# Altium project pump_controller_project.PrjPcb (part 2 of 2)

## Sheet MCU.SchDoc
size A3; SheetNumber: 9; SheetTotal: 9
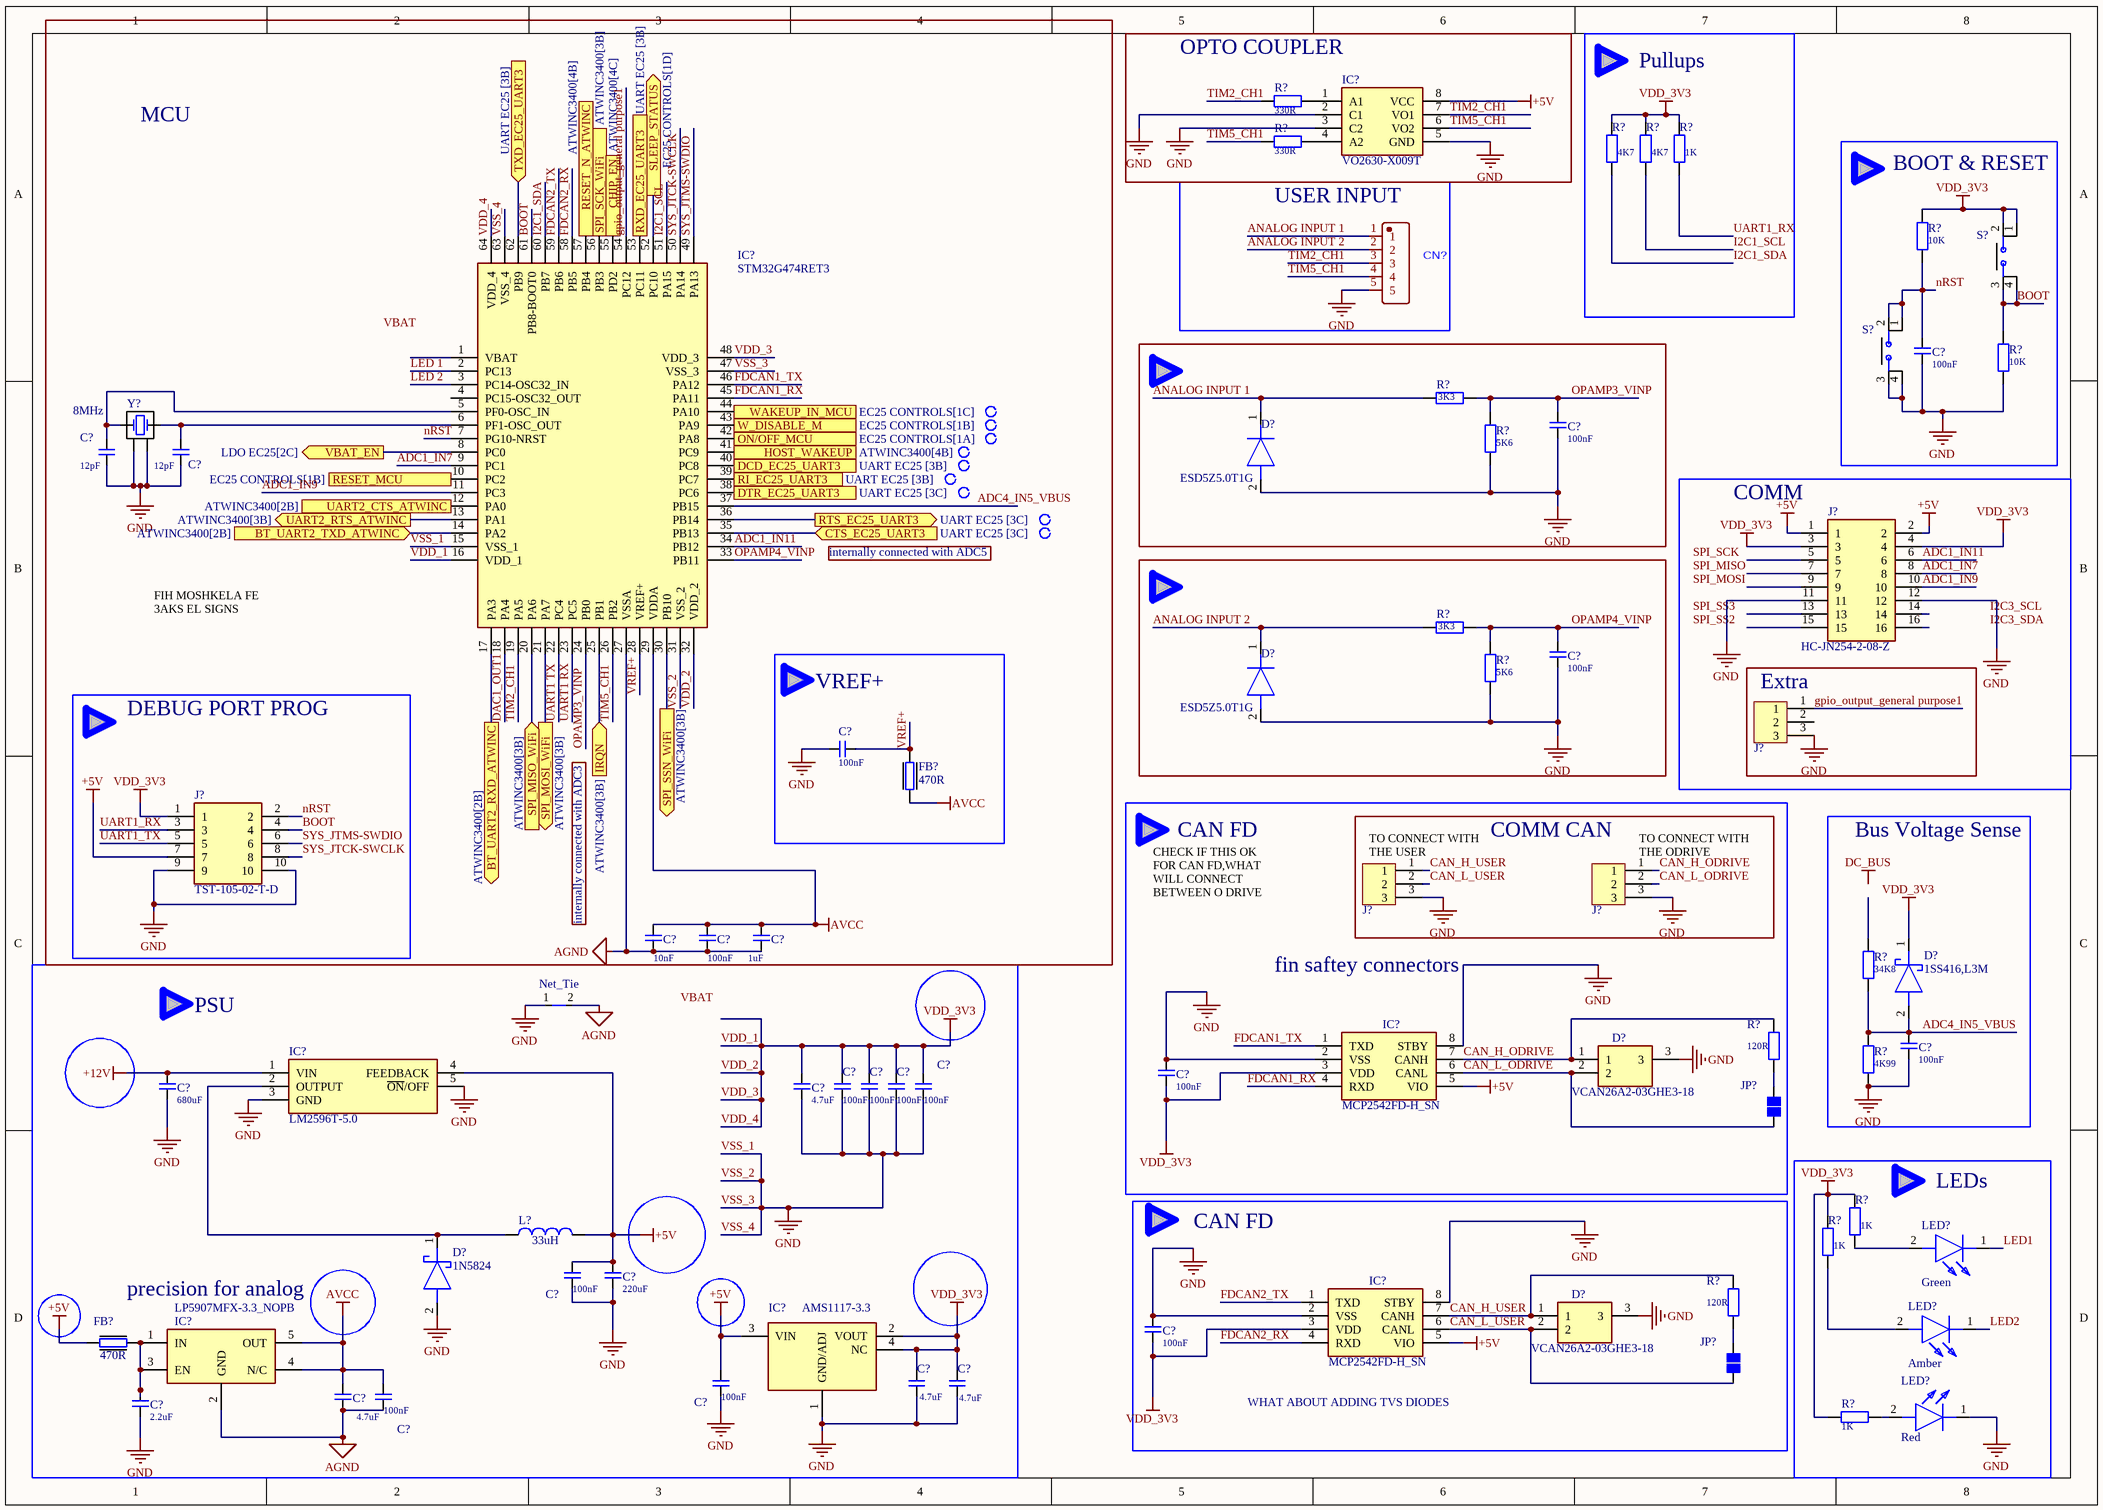
[diagram p10: MCU.SchDoc]

### Parts
(Parts that share a designator on the sheet are numbered #1, #2 ... from top to bottom, then left to right.)
C?#30  value 100nF  [CAPC1005X06N]  (hidden comment: Cap)
C?#31  value 100nF  [CAPC1005X06N]  (hidden comment: Cap)
C?#32  value 12pF  [CAPC1005X06N]  (hidden comment: Cap)
C?#33  value 12pF  [CAPC1005X06N]  (hidden comment: Cap)
C?#34  value 100nF  [CAPC1005X06N]  (hidden comment: Cap)
C?#35  value 100nF  [CAPC1005X06N]  (hidden comment: Cap)
C?#36  value 10nF  [CAPC1005X06N]  (hidden comment: Cap)
C?#37  value 100nF  [CAPC1005X06N]  (hidden comment: Cap)
C?#38  value 1uF  [CAPC1005X06N]  (hidden comment: Cap)
C?#39  value 100nF  [CAPC1005X06N]  (hidden comment: Cap)
C?#40  value 100nF  [CAPC1005X06N]  (hidden comment: Cap)
C?#41  value 680uF  [CAPC1005X06N]  (hidden comment: Cap)
C?#42  value 4.7uF  [CAPC3225X17N]  (hidden comment: Cap)
C?#43  value 100nF  [CAPC1005X06N]  (hidden comment: Cap)
C?#44  value 100nF  [CAPC1005X06N]  (hidden comment: Cap)
C?#45  value 100nF  [CAPC1005X06N]  (hidden comment: Cap)
C?#46  value 100nF  [CAPC1005X06N]  (hidden comment: Cap)
C?#47  value 100nF  [CAPC1005X06N]  (hidden comment: Cap)
C?#48  value 220uF  [CAPC1005X06N]  (hidden comment: Cap)
C?#49  value 100nF  [CAPC1005X06N]  (hidden comment: Cap)
C?#50  value 100nF  [CAPC1005X06N]  (hidden comment: Cap)
C?#51  value 4.7uF  [CAPC3225X17N]  (hidden comment: Cap)
C?#52  value 4.7uF  [CAPC3225X17N]  (hidden comment: Cap)
C?#53  value 4.7uF  [CAPC3225X17N]  (hidden comment: Cap)
C?#54  value 100nF  [CAPC1005X06N]  (hidden comment: Cap)
C?#55  value 2.2uF  [CAPC1005X06N]  (hidden comment: Cap)
CN?  (no value)  [CONN-TH_BX-XH2.54-5PZZ-Y]
D?#5  ESD5Z5.0T1G  [SODFL1608X70N]
D?#6  ESD5Z5.0T1G  [SODFL1608X70N]
D?#7  1SS416,L3M  [SODFL1006X45N]
D?#8  VCAN26A2-03GHE3-18  [SOT65P230X110-3N]
D?#9  1N5824  [1N5824]
D?#10  VCAN26A2-03GHE3-18  [SOT65P230X110-3N]
FB?#1  value 470R  [BLM18SP221SN1B]  (hidden comment: 470 OHM)
FB?#2  value 470R  [BLM18SP221SN1B]  (hidden comment: 470 OHM)
IC?#3  VO2630-X009T  [VO2630X009T]
IC?#4  STM32G474RET3  [QFP50P1200X1200X160-64N]
IC?#5  MCP2542FD-H_SN  [SOIC127P600X175-8N]
IC?#6  LM2596T-5.0  [TO170P470X1028X2142-5P]
IC?#7  MCP2542FD-H_SN  [SOIC127P600X175-8N]
IC?#8  AMS1117-3.3  [SOT229P700X180-4N]
IC?#9  LP5907MFX-3.3_NOPB  [SOT95P280X145-5N]
J?#6  MPN: HC-JN254-2-08-Z  [SHDR16W64P254_2X8_2794X927X940P]  (hidden comment: TST-108-02-T-D)
J?#7  XH2_54_3p  [XH2.54-3P]  (value not drawn)
J?#8  TST-105-02-T-D  [TST-105-XX-Y-D]
J?#9  XH2_54_3p  [XH2.54-3P]  (value not drawn)
J?#10  XH2_54_3p  [XH2.54-3P]  (value not drawn)
JP?#1  Jumper  [Jumper]  (value not drawn)  (no BOM)
JP?#2  Jumper  [Jumper]  (value not drawn)  (no BOM)
L?#2  value 33uH  [INDP6060X30N]  (hidden comment: L)
LED?#4  Green  [LEDC1608X80N]
LED?#5  Amber  [LEDC1608X80N]
LED?#6  Red  [LEDC1608X80N]
NT?  Net_Tie  [Net_Tie_SMD]  (net tie, no BOM)
R?#33  value 330R  [RESC1005X04N]  (hidden comment: R)
R?#34  value 330R  [RESC1005X04N]  (hidden comment: R)
R?#35  value 4K7  [RESC1005X04N]  (hidden comment: R)
R?#36  value 4K7  [RESC1005X04N]  (hidden comment: R)
R?#37  value 1K  [RESC1005X04N]  (hidden comment: R)
R?#38  value 10K  [RESC1005X04N]  (hidden comment: R)
R?#39  value 10K  [RESC1005X04N]  (hidden comment: R)
R?#40  value 3K3  [RESC1005X04N]  (hidden comment: R)
R?#41  value 5K6  [RESC1005X04N]  (hidden comment: R)
R?#42  value 3K3  [RESC1005X04N]  (hidden comment: R)
R?#43  value 5K6  [RESC1005X04N]  (hidden comment: R)
R?#44  value 34K8  [RESC1005X04N]  (hidden comment: R)
R?#45  value 120R  [RESC3216X06N]  (hidden comment: R)
R?#46  value 4K99  [RESC1005X04N]  (hidden comment: R)
R?#47  value 1K  [RESC1005X04N]  (hidden comment: R)
R?#48  value 1K  [RESC1005X04N]  (hidden comment: R)
R?#49  value 120R  [RESC3216X06N]  (hidden comment: R)
R?#50  value 1K  [RESC1005X04N]  (hidden comment: R)
S?#1  TS18-5-25-SL-260-SMT-TR  [TS18525SL260SMTTR]  (value not drawn)
S?#2  TS18-5-25-SL-260-SMT-TR  [TS18525SL260SMTTR]  (value not drawn)
Y?  value 8MHz  [830105863709]

### Blocks framed on the sheet
MCU: C?#32 C?#33 C?#36-C?#38 IC?#4 Y?
OPTO COUPLER: IC?#3 R?#33 R?#34
Pullups: R?#35-R?#37
BOOT & RESET: C?#30 R?#38 R?#39 S?#1 S?#2
USER INPUT: CN?
COMM: J?#6
VREF+: C?#35 FB?#1
Extra: J?#7
DEBUG PORT PROG: J?#8
COMM CAN: J?#9 J?#10
Bus Voltage Sense: C?#39 D?#7 R?#44 R?#46
CAN FD: C?#49 D?#10 IC?#7 JP?#2 R?#49
LEDs: LED?#4-LED?#6 R?#47 R?#48 R?#50

### Ports
BT_UART2_RXD_ATWINC (out, see ATWINC3400[2B]), BT_UART2_TXD_ATWINC (in, see ATWINC3400[2B]), CHIP_EN (out, see ATWINC3400[4C]), CTS_EC25_UART3 (in, see UART EC25 [3C]), DCD_EC25_UART3 (in, see UART EC25 [3B]), DTR_EC25_UART3 (out, see UART EC25 [3C]), HOST_WAKEUP (out, see ATWINC3400[4B]), IRQN (in, see ATWINC3400[3B]), ON/OFF_MCU (out, see EC25 CONTROLS[1A]), RESET_MCU (out, see EC25 CONTROLS[1B]), RESET_N_ATWINC (out, see ATWINC3400[4B]), RI_EC25_UART3 (in, see UART EC25 [3B]), RTS_EC25_UART3 (out, see UART EC25 [3C]), RXD_EC25_UART3 (out, see UART EC25 [3B]), SLEEP_STATUS (out, see EC25 CONTROLS[1D]), SPI_MISO_WiFi (in, see ATWINC3400[3B]), SPI_MOSI_WiFi (out, see ATWINC3400[3B]), SPI_SCK_WiFi (out, see ATWINC3400[3B]), SPI_SSN_WiFi (out, see ATWINC3400[3B]), TXD_EC25_UART3 (in, see UART EC25 [3B]), UART2_CTS_ATWINC (in, see ATWINC3400[2B]), UART2_RTS_ATWINC (out, see ATWINC3400[3B]), VBAT_EN (out, see LDO EC25[2C]), W_DISABLE_M (out, see EC25 CONTROLS[1B]), WAKEUP_IN_MCU (out, see EC25 CONTROLS[1C])

### Nets
+5V: C?#47.2 C?#48.2 C?#50.2 FB?#2.1 IC?#3.8(VCC) IC?#5.5(VIO) IC?#6.4(FEEDBACK) IC?#7.5(VIO) IC?#8.3(VIN) J?#6.1 J?#6.2 J?#8.7 L?#2.2
+12V: C?#41.2 IC?#6.1(VIN)
AGND: C?#36.2 C?#37.1 C?#38.2 C?#53.1 C?#54.1 IC?#4.27(VSSA) IC?#9.2(GND) NT?.2
AVCC: C?#36.1 C?#37.2 C?#38.1 C?#53.2 C?#54.2 FB?#1.1 IC?#4.29(VDDA) IC?#9.4(N/C) IC?#9.5(OUT)
VDD_1: C?#40.2 C?#42.2 C?#43.2 C?#44.2 C?#45.2 C?#46.2 C?#49.2 C?#51.2 C?#52.2 D?#7.1(K) IC?#4.16(VDD_1) IC?#4.32(VDD_2) IC?#4.48(VDD_3) IC?#4.64(VDD_4) IC?#5.3(VDD) IC?#7.3(VDD) IC?#8.2(VOUT) IC?#8.4(NC) J?#6.3 J?#6.4 J?#8.1 R?#35.1 R?#36.1 R?#37.1 R?#38.2 R?#47.1 R?#48.1 R?#50.2 S?#1.1(NO_1) S?#1.2(NO_2)  [also labelled VDD_2, VDD_3, VDD_3V3, VDD_4]
VSS_1: C?#30.1 C?#31.1 C?#32.1 C?#33.1 C?#34.1 C?#35.1 C?#39.1 C?#40.1 C?#41.1 C?#42.1 C?#43.1 C?#44.1 C?#45.1 C?#46.1 C?#47.1 C?#48.1 C?#49.1 C?#50.1 C?#51.1 C?#52.1 C?#55.1 CN?.5 D?#5.2(A) D?#6.2(A) D?#8.3 D?#9.2(A) D?#10.3 IC?#3.2(C1) IC?#3.3(C2) IC?#3.5(GND) IC?#4.15(VSS_1) IC?#4.31(VSS_2) IC?#4.47(VSS_3) IC?#4.63(VSS_4) IC?#5.2(VSS) IC?#5.8(STBY) IC?#6.3(GND) IC?#6.5(~{ON}/OFF) IC?#7.2(VSS) IC?#7.8(STBY) IC?#8.1(GND/ADJ) J?#6.11 J?#6.12 J?#7.3 J?#8.9 J?#8.10 J?#9.3 J?#10.3 LED?#6.1(K) NT?.1 R?#39.1 R?#41.2 R?#43.2 R?#46.2 S?#2.3(COM_1) S?#2.4(COM_2) Y?.2(GND_&_LID_1) Y?.4(GND_&_LID_2)  [also labelled GND, VSS_2, VSS_3, VSS_4]
ADC1_IN7: IC?#4.9(PC1) J?#6.8
ADC1_IN9: IC?#4.11(PC3) J?#6.10
ADC1_IN11: IC?#4.34(PB12) J?#6.6
ADC4_IN5_VBUS: C?#39.2 D?#7.2(A) IC?#4.37(PB15) R?#44.2 R?#46.1
ANALOG INPUT 1: CN?.1 D?#5.1(K) R?#40.2
ANALOG INPUT 2: CN?.2 D?#6.1(K) R?#42.2
BOOT: IC?#4.61(PB8-BOOT0) J?#8.4 R?#39.2 S?#1.3(COM_1) S?#1.4(COM_2)
CAN_H_ODRIVE: D?#8.1 IC?#5.7(CANH) J?#10.1 R?#45.2
CAN_H_USER: D?#10.1 IC?#7.7(CANH) J?#9.1 R?#49.2
CAN_L_ODRIVE: D?#8.2 IC?#5.6(CANL) J?#10.2 JP?#1.1
CAN_L_USER: D?#10.2 IC?#7.6(CANL) J?#9.2 JP?#2.1
DAC1_OUT1: IC?#4.18(PA4)
FDCAN1_RX: IC?#4.45(PA11) IC?#5.4(RXD)
FDCAN1_TX: IC?#4.46(PA12) IC?#5.1(TXD)
FDCAN2_RX: IC?#4.58(PB5) IC?#7.4(RXD)
FDCAN2_TX: IC?#4.59(PB6) IC?#7.1(TXD)
gpio_output_general purpose1: IC?#4.54(PC12) J?#7.1
I2C1_SCL: IC?#4.51(PA15) R?#36.2
I2C1_SDA: IC?#4.60(PB7) R?#35.2
LED1: LED?#4.1(K)
LED2: LED?#5.1(K)
LED 1: IC?#4.2(PC13)
LED 2: IC?#4.3(PC14-OSC32_IN)
nRST: C?#30.2 IC?#4.7(PG10-NRST) J?#8.2 R?#38.1 S?#2.1(NO_1) S?#2.2(NO_2)
OPAMP3_VINP: C?#31.2 IC?#4.24(PB0) R?#40.1 R?#41.1
OPAMP4_VINP: C?#34.2 IC?#4.33(PB11) R?#42.1 R?#43.1
SYS_JTCK-SWCLK: IC?#4.50(PA14) J?#8.8
SYS_JTMS-SWDIO: IC?#4.49(PA13) J?#8.6
TIM2_CH1: CN?.3 IC?#3.7(VO1) IC?#4.19(PA5) R?#33.1
TIM5_CH1: CN?.4 IC?#3.6(VO2) IC?#4.26(PB2) R?#34.1
UART1 RX: IC?#4.23(PC5)
UART1 TX: IC?#4.22(PC4)
UART1_RX: J?#8.3 R?#37.2
UART1_TX: J?#8.5
VREF+: C?#35.2 FB?#1.2 IC?#4.28(VREF+)
NetC?#32_2: C?#32.2 IC?#4.5(PF0-OSC_IN) Y?.1(CRYSTAL__1)
NetC?#33_2: C?#33.2 IC?#4.6(PF1-OSC_OUT) Y?.3(CRYSTAL__2)
NetC?#55_2: C?#55.2 FB?#2.2 IC?#9.1(IN) IC?#9.3(EN)
NetD?#9_1: D?#9.1(K) IC?#6.2(OUTPUT) L?#2.1
NetIC?#1_12: IC?#4.36(PB14) ; port RTS_EC25_UART3
NetIC?#1_13: IC?#4.35(PB13) ; port CTS_EC25_UART3
NetIC?#1_14: IC?#4.38(PC6) ; port DTR_EC25_UART3
NetIC?#1_15: IC?#4.39(PC7) ; port RI_EC25_UART3
NetIC?#1_16: IC?#4.53(PC11) ; port RXD_EC25_UART3
NetIC?#1_17: IC?#4.62(PB9) ; port TXD_EC25_UART3
NetIC?#1_18: IC?#4.40(PC8) ; port DCD_EC25_UART3
NetIC?#3_1: IC?#3.1(A1) R?#33.2
NetIC?#3_4: IC?#3.4(A2) R?#34.2
NetIC?#4_8: IC?#4.8(PC0) ; port VBAT_EN
NetIC?#4_10: IC?#4.10(PC2) ; port RESET_MCU
NetIC?#4_12: IC?#4.12(PA0) ; port UART2_CTS_ATWINC
NetIC?#4_13: IC?#4.13(PA1) ; port UART2_RTS_ATWINC
NetIC?#4_14: IC?#4.14(PA2) ; port BT_UART2_TXD_ATWINC
NetIC?#4_17: IC?#4.17(PA3) ; port BT_UART2_RXD_ATWINC
NetIC?#4_20: IC?#4.20(PA6) ; port SPI_MISO_WiFi
NetIC?#4_21: IC?#4.21(PA7) ; port SPI_MOSI_WiFi
NetIC?#4_25: IC?#4.25(PB1) ; port IRQN
NetIC?#4_30: IC?#4.30(PB10) ; port SPI_SSN_WiFi
NetIC?#4_41: IC?#4.41(PC9) ; port HOST_WAKEUP
NetIC?#4_42: IC?#4.42(PA8) ; port ON/OFF_MCU
NetIC?#4_43: IC?#4.43(PA9) ; port W_DISABLE_M
NetIC?#4_44: IC?#4.44(PA10) ; port WAKEUP_IN_MCU
NetIC?#4_52: IC?#4.52(PC10) ; port SLEEP_STATUS
NetIC?#4_55: IC?#4.55(PD2) ; port CHIP_EN
NetIC?#4_56: IC?#4.56(PB3) ; port SPI_SCK_WiFi
NetIC?#4_57: IC?#4.57(PB4) ; port RESET_N_ATWINC
NetJP?#1_2: JP?#1.2 R?#45.1
NetJP?#2_2: JP?#2.2 R?#49.1
NetLED?#4_2: LED?#4.2(A) R?#47.2
NetLED?#5_2: LED?#5.2(A) R?#48.2
NetLED?#6_2: LED?#6.2(A) R?#50.1

Not connected (* = marked no-connect by the designer): IC?#4 1(VBAT) 4(PC15-OSC32_OUT); J?#6 5 7 9 13 14 15 16; J?#7 2; R?#44 1

### Notes on the sheet
- internally connected with ADC5
- FIH MOSHKELA FE 3AKS EL SIGNS
- CAN FD
- (near J?#9) TO CONNECT WITH THE USER
- (near J?#10) TO CONNECT WITH THE ODRIVE
- internally connected with ADC3
- CHECK IF THIS OK FOR CAN FD,WHAT WILL CONNECT BETWEEN O DRIVE AND ALSO THE USER
- fin saftey connectors
- PSU
- precision for analog
- WHAT ABOUT ADDING TVS DIODES
- Labels drawn without touching a wire or pin: DC_BUS, I2C3_SCL, I2C3_SDA, SPI_MISO, SPI_MOSI, SPI_SCK, SPI_SS2, SPI_SS3, VBAT

### Library data of the parts
C?#30 C?#31 C?#34 C?#35 C?#37 C?#39 C?#40 C?#43-C?#47 C?#49 C?#50 C?#54 = Cap: Capacitor; MPN: GCM155R71H104KE02D; Link: https://jlcpcb.com/partdetail/MurataElectronics-GCM155R71H104KE02D/C85858; Price: 0.0031
C?#32 C?#33 = Cap: Capacitor; MPN: GRM1555C1H120JA01D; Link: https://jlcpcb.com/partdetail/MurataElectronics-GRM1555C1H120JA01D/C76948; Price: 0.0028
C?#36 C?#41 C?#48 = Cap: Capacitor
C?#38 = Cap: Capacitor; MPN: GRM155Z71A105KE01D; Link: https://jlcpcb.com/partdetail/548880-GRM155Z71A105KE01D/C528974; Price: 0.0206
C?#42 C?#51-C?#53 = Cap: Capacitor; MPN: CC1210KKX7R8BB475; Link: https://www.lcsc.com/product-detail/Multilayer-Ceramic-Capacitors-MLCC-SMD-SMT_YAGEO-CC1210KKX7R8BB475_C2980104.html; Price: 0.1519
C?#55 = Cap: Capacitor; MPN: GRM155Z71A225KE44D; Link: https://jlcpcb.com/partdetail/3478404-GRM155Z71A225KE44D/C2999759; Price: 0.0332
CN? = BX-XH2.54-5PZZ-Y COPY
D?#5 D?#6 = ESD5Z5.0T1G: Diode; Manufacturer_Name: onsemi; Datasheet Link: http://www.onsemi.com/pub/Collateral/ESD5Z2.5T1-D.PDF; Height: 0.7mm; Mouser Part Number: 863-ESD5Z5.0T1G; Mouser Price/Stock: https://www.mouser.co.uk/ProductDetail/onsemi/ESD5Z5.0T1G?qs=OSf9jACorvYw3fDx1S8P6A%3D%3D; Arrow Part Number: ESD5Z5.0T1G; Arrow Price/Stock: https://www.arrow.com/en/products/esd5z5.0t1g/on-semiconductor?utm_currency=USD&region=nac; MPN: ESD5Z5.0T1G; link: https://www.lcsc.com/product-detail/ESD-and-Surge-Protection-TVS-ESD_BORN-ESD5Z5-0T1G_C343989.html?s_z=n_ESD5Z5.0T1G
D?#7 = 1SS416,L3M: Schottky Diode; Manufacturer_Name: Toshiba; MPN: 1SS416,L3M(B; Datasheet Link: http://toshiba.semicon-storage.com/info/docget.jsp?did=344&prodName=1SS416; Height: 0.45mm; Mouser Part Number: 757-1SS416L3M; Mouser Price/Stock: https://www.mouser.co.uk/ProductDetail/Toshiba/1SS416L3M?qs=G9o9YCnxvoYU%252BWabcXJZJg%3D%3D; Arrow Part Number: 1SS416,L3M; Arrow Price/Stock: https://www.arrow.com/en/products/1ss416l3m/toshiba?region=nac; Link: https://www.lcsc.com/product-detail/Schottky-Diodes_TOSHIBA-1SS416-L3M-B_C2943683.html; Price: 0.0251
D?#8 D?#10 = VCAN26A2-03GHE3-18: TVS Diode (Bi-directional); Manufacturer_Name: Vishay; Datasheet Link: http://www.mouser.com/datasheet/2/427/vcan26a2-03g-748292.pdf; Height: 1.1mm; Manufacturer_Part_Number: VCAN26A2-03GHE3-18; Mouser Part Number: 78-VCAN26A2-03GHE318; Mouser Price/Stock: https://www.mouser.co.uk/ProductDetail/Vishay-Semiconductors/VCAN26A2-03GHE3-18?qs=53vSufdqhLobCHEQZw8sJw%3D%3D
D?#9 = 1N5824: Schottky Diode; Manufacturer_Name: Microchip; Datasheet Link: https://www.microsemi.com/document-portal/doc_download/5865-1n5823-25-datasheet; Height: 11.43mm; Manufacturer_Part_Number: 1N5824; Mouser Part Number: 494-1N5824; Mouser Price/Stock: https://www.mouser.co.uk/ProductDetail/Microchip-Technology/1N5824?qs=TXMzd3F6EyleEEWqakQxJw%3D%3D; Arrow Part Number: 1N5824; Arrow Price/Stock: https://www.arrow.com/en/products/1n5824/microchip-technology?utm_currency=USD&region=nac
FB?#1 FB?#2 = BLM18KG471SN1D: Ferrite Bead; Manufacturer_Name: Murata Electronics; Datasheet Link: http://www.murata.com/~/media/webrenewal/support/library/catalog/products/emc/emifil/c31e.ashx?la=en-gb; Height: 0.95mm; MPN: BLM18KG471SN1D; Mouser Part Number: 81-BLM18KG471SN1D; Mouser Price/Stock: https://www.mouser.co.uk/ProductDetail/Murata-Electronics/BLM18KG471SN1D?qs=rvfpa0%252BU10NIg0zs9veElg%3D%3D; Arrow Part Number: BLM18KG471SN1D; Arrow Price/Stock: https://www.arrow.com/en/products/blm18kg471sn1d/murata-manufacturing?region=europe; Link: https://www.lcsc.com/product-detail/Ferrite-Beads_Murata-Electronics-BLM18KG471SN1D_C413961.html
IC?#3 = VO2630-X009T: Integrated Circuit; Manufacturer_Name: Vishay; Datasheet Link: https://componentsearchengine.com/Datasheets/1/VO2630-X009T.pdf; Height: 4.01mm; Manufacturer_Part_Number: VO2630-X009T; Mouser Part Number: 78-VO2630-X009T; Mouser Price/Stock: https://www.mouser.co.uk/ProductDetail/Vishay-Semiconductors/VO2630-X009T?qs=5csRq1wdUj4uarriRg0CFA%3D%3D; Arrow Part Number: VO2630-X009T; Arrow Price/Stock: https://www.arrow.com/en/products/vo2630-x009t/vishay?region=nac
IC?#4 = STM32G474RET3: Integrated Circuit; Manufacturer_Name: STMicroelectronics; Datasheet Link: https://www.st.com/resource/en/datasheet/stm32g474re.pdf; Height: 1.6mm; Manufacturer_Part_Number: STM32G474RET3; Mouser Part Number: 511-STM32G474RET3; Mouser Price/Stock: https://www.mouser.co.uk/ProductDetail/STMicroelectronics/STM32G474RET3?qs=xZ%2FP%252Ba9zWqYL6K%252Ba4ZBwGg%3D%3D; Arrow Part Number: STM32G474RET3; Arrow Price/Stock: https://www.arrow.com/en/products/stm32g474ret3/stmicroelectronics?utm_currency=USD&region=nac
IC?#5 IC?#7 = MCP2542FD-H_SN: Integrated Circuit; Manufacturer_Name: Microchip; Manufacturer_Part_Number: MCP2542FD-H/SN; Datasheet Link: http://ww1.microchip.com/downloads/en/devicedoc/20005514a.pdf; Height: 1.75mm; Mouser Part Number: 579-MCP2542FD-H/SN; Mouser Price/Stock: https://www.mouser.co.uk/ProductDetail/Microchip-Technology/MCP2542FD-H-SN?qs=qdgZG5p0FZ4YwT%252BnBHAU%252BQ%3D%3D; Arrow Part Number: MCP2542FD-H/SN; Arrow Price/Stock: https://www.arrow.com/en/products/mcp2542fd-hsn/microchip-technology?region=nac
IC?#6 = LM2596T-5.0: Integrated Circuit; Manufacturer_Name: Texas Instruments; Datasheet Link: http://www.ti.com/general/docs/lit/getliterature.tsp?genericPartNumber=lm2596&fileType=pdf; Height: 4.7mm; Manufacturer_Part_Number: LM2596T-5.0; Mouser Part Number: 926-LM2596T-50; Mouser Price/Stock: https://www.mouser.co.uk/ProductDetail/Texas-Instruments/LM2596T-5.0?qs=X1J7HmVL2ZHGhhjJIS7EQw%3D%3D; Arrow Part Number: LM2596T-5.0; Arrow Price/Stock: null?region=nac
IC?#8 = AMS1117-3.3: Integrated Circuit; Manufacturer_Name: Advanced; Datasheet Link: https://datasheet.datasheetarchive.com/originals/distributors/Datasheets-28/DSA-550594.pdf; Height: 1.8mm; MPN: AMS1117-3.3; Link: https://www.lcsc.com/product-detail/Voltage-Regulators-Linear-Low-Drop-Out-LDO-Regulators_Advanced-Monolithic-Systems-AMS1117-3-3_C6186.html; Price: 0.1342
IC?#9 = LP5907MFX-3.3_NOPB: Integrated Circuit; Manufacturer_Name: Texas Instruments; MPN: LP5907MFX-3.3/NOPB; Datasheet Link: https://datasheet.datasheetarchive.com/originals/distributors/Datasheets-SFU2/DSASFU100037200.pdf; Height: 1.45mm; Mouser Part Number: 595-LP5907MFX-3.3NPB; Mouser Price/Stock: https://www.mouser.co.uk/ProductDetail/Texas-Instruments/LP5907MFX-3.3-NOPB?qs=biyDIajrTn6NhrJCoL%2FdSQ%3D%3D; Arrow Part Number: LP5907MFX-3.3/NOPB; Arrow Price/Stock: https://www.arrow.com/en/products/lp5907mfx-3.3nopb/texas-instruments?utm_currency=USD&region=nac; Link: https://www.lcsc.com/product-detail/Voltage-Regulators-Linear-Low-Drop-Out-LDO-Regulators_Texas-Instruments-LP5907MFX-3-3-NOPB_C80670.html; Price: 0.1083
J?#6 = TST-108-02-T-D: Connector; Mouser Part Number: 200-TST10802TD; Mouser Price/Stock: https://www.mouser.co.uk/ProductDetail/Samtec/TST-108-02-T-D?qs=rU5fayqh%252BE1iZn2yp3BQ2w%3D%3D; Arrow Part Number: TST-108-02-T-D; Arrow Price/Stock: https://www.arrow.com/en/products/tst-108-02-t-d/samtec?region=nac; Link: https://www.lcsc.com/product-detail/IDC-Connectors_HCTL-HC-JN254-2-08-Z_C5372867.html; Price: 0.0987
J?#7 J?#9 J?#10 = XH2_54_3p: MPN: ZX-XH2.54-3PZZ; Link: https://www.lcsc.com/product-detail/Wire-To-Board-Connector_Megastar-ZX-XH2-54-3PZZ_C7429633.html; Price: 0.0073
J?#8 = TST-105-02-T-D: Connector; Manufacturer_Name: SAMTEC; MPN: ZX-IDC2.54-2-5PZZ; Datasheet Link: http://suddendocs.samtec.com/prints/tst-1xx-xx-x-x-xx-xx-mkt.pdf; Mouser Part Number: 200-TST10502TD; Mouser Price/Stock: https://www.mouser.co.uk/ProductDetail/Samtec/TST-105-02-T-D?qs=rU5fayqh%252BE1w4XXP0IOe8w%3D%3D; Arrow Part Number: TST-105-02-T-D; Arrow Price/Stock: https://www.arrow.com/en/products/tst-105-02-t-d/samtec?region=nac; Link: https://www.lcsc.com/product-detail/IDC-Connectors_Megastar-ZX-IDC2-54-2-5PZZ_C7501191.html?s_z=n_IDC%20Connector; Price: 0.1126
LED?#4 = 150060SS75000: LED; Manufacturer_Name: Wurth Elektronik; MPN: XL-1608UGC-04; Height: 0.8mm; Mouser Part Number: 710-150060SS75000; Mouser Price/Stock: https://www.mouser.co.uk/ProductDetail/Wurth-Elektronik/150060SS75000?qs=LlUlMxKIyB0oQaxwspeTEA%3D%3D; Price: 0.0041; Link: https://www.lcsc.com/product-detail/LED-Indication-Discrete_XINGLIGHT-XL-1608UGC-04_C965804.html
LED?#5 = 150060SS75000: LED; Manufacturer_Name: Wurth Elektronik; MPN: BL-HJC36G-AV-TRB; Height: 0.8mm; Mouser Part Number: 710-150060SS75000; Mouser Price/Stock: https://www.mouser.co.uk/ProductDetail/Wurth-Elektronik/150060SS75000?qs=LlUlMxKIyB0oQaxwspeTEA%3D%3D; Price: 0.; Link: https://www.lcsc.com/product-detail/LED-Indication-Discrete_BrtLed-Bright-LED-Elec-BL-HJC36G-AV-TRB_C165983.html?s_z=n_led%200603
LED?#6 = 150060SS75000: LED; Manufacturer_Name: Wurth Elektronik; MPN: XL-1608SURC-06; Height: 0.8mm; Mouser Part Number: 710-150060SS75000; Mouser Price/Stock: https://www.mouser.co.uk/ProductDetail/Wurth-Elektronik/150060SS75000?qs=LlUlMxKIyB0oQaxwspeTEA%3D%3D; Price: 0.003; Link: https://www.lcsc.com/product-detail/LED-Indication-Discrete_XINGLIGHT-XL-1608SURC-06_C965799.html
NT? = Net_Tie: Net Tie
R?#33 R?#34 = R: Resistor
R?#35 R?#36 = R: Resistor; MPN: RC0402FR-074K7L; Link: https://jlcpcb.com/partdetail/Yageo-RC0402FR074K7L/C105871; Price: 0.0006
R?#37 R?#47 R?#48 R?#50 = R: Resistor; MPN: RC0402FR-071KL; Link: RC0402FR-071KL; Price: 0.0006
R?#38 R?#39 = R: Resistor; MPN: RC0402FR-0710KL; Link: https://jlcpcb.com/partdetail/Yageo-RC0402FR0710KL/C60490; Price: 0.0005
R?#40 R?#42 = R: Resistor; MPN: RC0402FR-073K3L; Link: https://jlcpcb.com/partdetail/Yageo-RC0402FR073K3L/C137992; Price: 0.0006
R?#41 R?#43 = R: Resistor; MPN: RC0402FR-075K6L; Link: https://jlcpcb.com/partdetail/Yageo-RC0402FR075K6L/C163457; Price: 0.0005
R?#44 = R: Resistor; MPN: RC0402FR-0734K8L; Link: https://jlcpcb.com/partdetail/Yageo-RC0402FR0734K8L/C327350; Price: 0.0006
R?#45 R?#49 = R: Resistor; MPN: RC1206FR-07120RL; Link: https://www.lcsc.com/product-detail/Chip-Resistor-Surface-Mount_YAGEO-RC1206FR-07120RL_C114928.html; Price: 0.0036
R?#46 = R: Resistor; MPN: RC0402FR-074K99L; Link: https://jlcpcb.com/partdetail/Yageo-RC0402FR074K99L/C137965; Price: 0.0006
S?#1 S?#2 = TS18-5-25-SL-260-SMT-TR: Switch; Manufacturer_Name: Same Sky; MPN: GT-TC084B-H015-L5; Datasheet Link: https://www.sameskydevices.com/product/resource/supplyframepdf/ts18.pdf; Height: 2.7mm; Mouser Part Number: 179-TS18525SL260SMTT; Mouser Price/Stock: https://www.mouser.co.uk/ProductDetail/Same-Sky/TS18-5-25-SL-260-SMT-TR?qs=tlsG%2FOw5FFh0yS4gYnfcwg%3D%3D; Link: https://www.lcsc.com/product-detail/Tactile-Switches_G-Switch-GT-TC084B-H015-L5_C778173.html; Price: 0.049
Y? = XTAL_3225: Crystal or Oscillator; Manufacturer_Name: Wurth Elektronik; MPN: XL2EL89COI-111YLC-8M; Datasheet Link: https://www.we-online.com/catalog/datasheet/830105863709.pdf; Height: 0.8mm; Mouser Part Number: 710-830105863709; Mouser Price/Stock: https://www.mouser.co.uk/ProductDetail/Wurth-Elektronik/830105863709?qs=hd1VzrDQEGgXVxZIC%252BUALw%3D%3D; Link: https://www.lcsc.com/product-detail/Crystals_YXC-Crystal-Oscillators-XL2EL89COI-111YLC-8M_C2973805.html; Price: 0.115

## Nets that join several sheets
+5V: indicators (LED?#1.2 LED?#2.2 Q?#2.2 R?#12.1), MCU (13 pins)
VBAT: EC25 (U?#1.57 U?#1.58 U?#1.59 U?#1.60), LDO EC25 (5 pins), VBAT design EC25 (9 pins), RF EC25 (C?#26.1 R?#32.2)
VSS_1: EC25 (42 pins), UART EC25  (6 pins), LDO EC25 (10 pins), U SIM EC25 (C?#8.1 C?#9.1 C?#10.1 D?#2.2), VBAT design EC25 (9 pins), indicators (Q?#3.2 Q?#4.2 R?#16.1), ATWINC3400 (13 pins), EC25 CONTROLS (Q?#5.2 Q?#6.2 Q?#7.2 Q?#8.2), RF EC25 (13 pins), MCU (58 pins)
NetC?#7_2: EC25 (U?#1.10), U SIM EC25 (5 pins)
NetC?#23_2: EC25 (U?#1.49), RF EC25 (C?#23.2 R?#30.2)
NetC?#25_2: EC25 (U?#1.35), RF EC25 (C?#25.2 R?#31.2)
NetC?#27_1: EC25 (U?#1.47), RF EC25 (C?#27.1 C?#29.2)
NetD?#2_5: EC25 (U?#1.13), U SIM EC25 (D?#2.5 J?#1.C5 R?#8.1)
NetIC?#1_3: EC25 (U?#1.63), UART EC25  (IC?#1.3)
NetIC?#1_4: EC25 (U?#1.67), UART EC25  (IC?#1.4)
NetIC?#1_5: EC25 (U?#1.68), UART EC25  (IC?#1.5)
NetIC?#1_6: EC25 (U?#1.62), UART EC25  (IC?#1.6)
NetIC?#1_7: EC25 (U?#1.66), UART EC25  (IC?#1.7)
NetIC?#1_8: EC25 (U?#1.64), UART EC25  (IC?#1.8)
NetIC?#1_9: EC25 (U?#1.65), UART EC25  (IC?#1.9)
NetIC?#1_12: UART EC25  (IC?#1.12), MCU (IC?#4.36)
NetIC?#1_13: UART EC25  (IC?#1.13), MCU (IC?#4.35)
NetIC?#1_14: UART EC25  (IC?#1.14), MCU (IC?#4.38)
NetIC?#1_15: UART EC25  (IC?#1.15), MCU (IC?#4.39)
NetIC?#1_16: UART EC25  (IC?#1.16), MCU (IC?#4.53)
NetIC?#1_17: UART EC25  (IC?#1.17), MCU (IC?#4.62)
NetIC?#1_18: UART EC25  (IC?#1.18), MCU (IC?#4.40)
NetIC?#4_8: LDO EC25 (Q?#1.1), MCU (IC?#4.8)
NetIC?#4_10: EC25 CONTROLS (Q?#7.1), MCU (IC?#4.10)
NetIC?#4_12: ATWINC3400 (U?#2.10), MCU (IC?#4.12)
NetIC?#4_13: ATWINC3400 (U?#2.11), MCU (IC?#4.13)
NetIC?#4_14: ATWINC3400 (U?#2.8), MCU (IC?#4.14)
NetIC?#4_17: ATWINC3400 (U?#2.9), MCU (IC?#4.17)
NetIC?#4_20: ATWINC3400 (U?#2.24), MCU (IC?#4.20)
NetIC?#4_21: ATWINC3400 (U?#2.26), MCU (IC?#4.21)
NetIC?#4_25: ATWINC3400 (U?#2.33), MCU (IC?#4.25)
NetIC?#4_30: ATWINC3400 (U?#2.25), MCU (IC?#4.30)
NetIC?#4_41: ATWINC3400 (R?#22.1), MCU (IC?#4.41)
NetIC?#4_42: EC25 CONTROLS (Q?#5.1), MCU (IC?#4.42)
NetIC?#4_43: EC25 CONTROLS (Q?#6.1), MCU (IC?#4.43)
NetIC?#4_44: EC25 CONTROLS (Q?#8.1), MCU (IC?#4.44)
NetIC?#4_52: EC25 CONTROLS (Q?#9.1), MCU (IC?#4.52)
NetIC?#4_55: ATWINC3400 (U?#2.19), MCU (IC?#4.55)
NetIC?#4_56: ATWINC3400 (U?#2.23), MCU (IC?#4.56)
NetIC?#4_57: ATWINC3400 (R?#17.2), MCU (IC?#4.57)
NetQ?#3_1: EC25 (U?#1.6), indicators (Q?#3.1)
NetQ?#4_1: EC25 (U?#1.5), indicators (Q?#4.1)
NetQ?#5_3: EC25 (U?#1.21), EC25 CONTROLS (Q?#5.3)
NetQ?#6_3: EC25 (U?#1.4), EC25 CONTROLS (Q?#6.3)
NetQ?#7_3: EC25 (U?#1.20), EC25 CONTROLS (Q?#7.3)
NetQ?#8_3: EC25 (U?#1.1), EC25 CONTROLS (Q?#8.3)
NetQ?#9_3: EC25 (U?#1.2), EC25 CONTROLS (Q?#9.3 R?#29.1)
NetR?#9_1: EC25 (U?#1.17), U SIM EC25 (R?#9.1)
NetR?#10_1: EC25 (U?#1.16), U SIM EC25 (R?#10.1)
NetR?#11_1: EC25 (U?#1.15), U SIM EC25 (R?#11.1)
NetR?#13_1: EC25 (U?#1.61), indicators (R?#13.1)